# EAGLE design shadower (EAGLE 7.2.0)
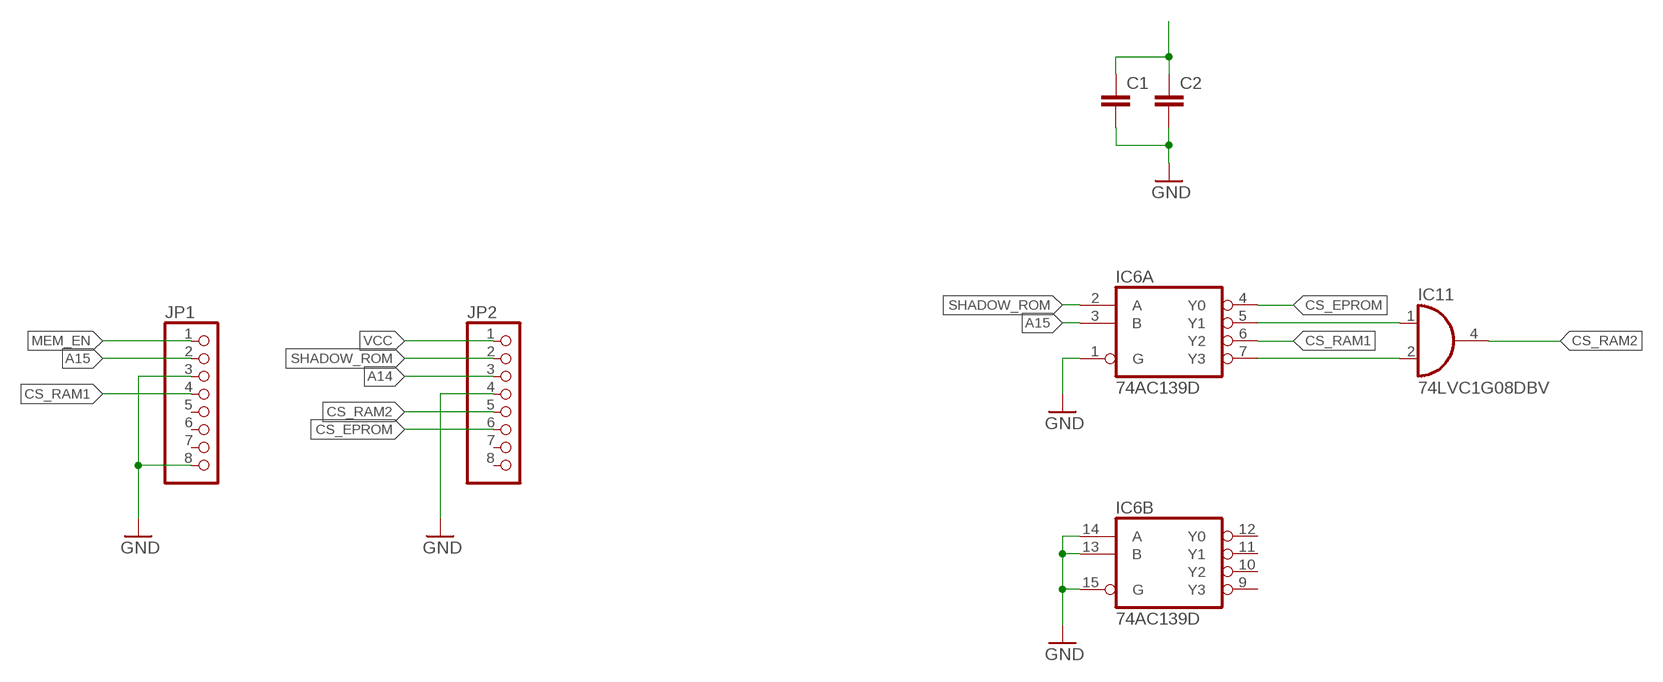
[diagram p0: schematic, sheet 1]

## Parts
C1  C-EUC0603  [C0603]
C2  C-EUC0603  [C0603]
IC6  74AC139D  [SO16]
IC11  74LVC1G08DBV  [SOT23-5]
JP1  PINHD-1X8  [1X08]
JP2  PINHD-1X8  [1X08]

## Nets
A14: JP2.3
A15: IC6.3(A:B) JP1.2
CS_EPROM: IC6.4(A:Y0) JP2.6
CS_RAM1: IC6.6(A:Y2) JP1.4
CS_RAM2: IC11.4(O) JP2.5
GND: C1.2 C2.2 IC6.1(A:G) IC6.13(B:B) IC6.14(B:A) IC6.15(B:G) JP1.3 JP1.8 JP2.4
MEM_EN: JP1.1
N$2: IC6.5(A:Y1) IC11.1(I0)
N$8: IC6.7(A:Y3) IC11.2(I1)
SHADOW_ROM: IC6.2(A:A) JP2.2
VCC: C1.1 C2.1 JP2.1
Unconnected: IC6.9(B:Y3) IC6.10(B:Y2) IC6.11(B:Y1) IC6.12(B:Y0) JP1.5 JP1.6 JP1.7 JP2.7 JP2.8

## Power pins joined to a net without a drawn wire
GND: IC6.8(P:GND) IC11.3(GND)
VCC: IC6.16(P:VCC) IC11.5(VCC)

## Library data of the parts
C1 C2 = rcl:C-EU: CAPACITOR, European symbol
IC6 = 74xx-eu:74*139: Dual 2-line to 4-line DECODER/DEMULTIPLEXER
IC11 = 74xx-little-de:74*1G08: 2-input AND gate
JP1 JP2 = pinhead:PINHD-1X8: PIN HEADER

## Board
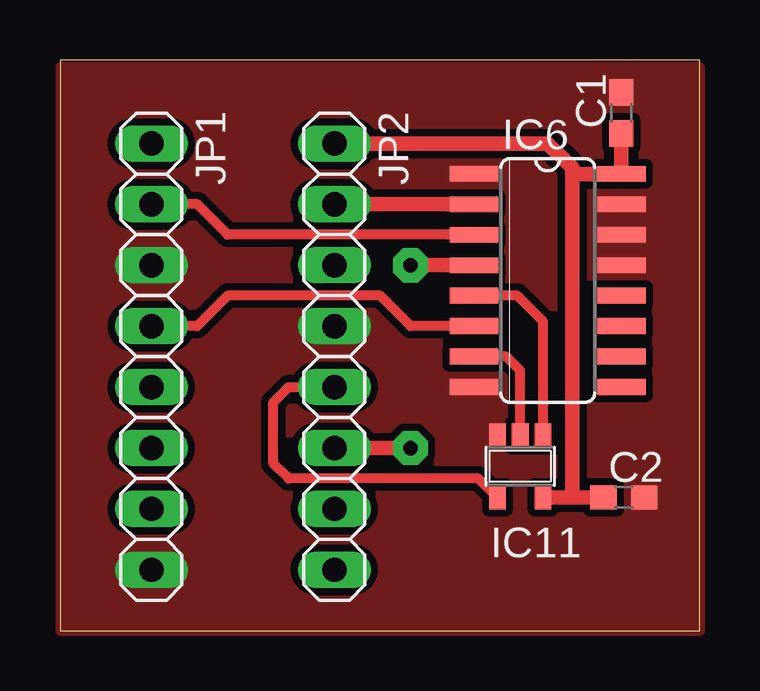
[diagram p1: board, top side]
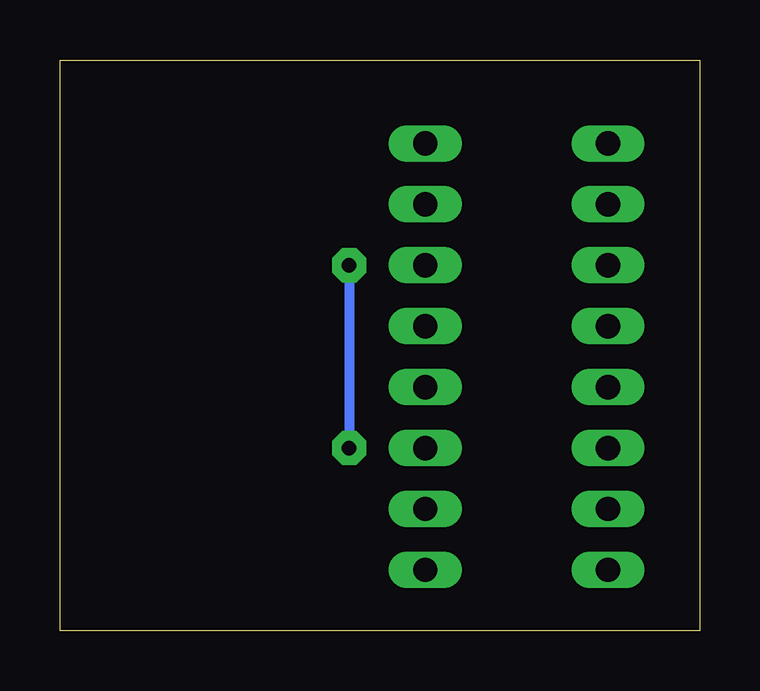
[diagram p2: board, bottom side, seen from below]

Size 26.65 x 23.8 mm. Coordinates in mm from the lower left corner, seen from the top.
Outline: 0,0 26.65,0 26.65,23.8 0,23.8 0,0
Copper layers (1*16): Top 0.035mm / dielectric 1.5mm / Bottom 0.035mm
Design rules "default *": minimum track width 10mil, minimum drill 24mil, track to track 8mil, track to pad 8mil, pad to pad 8mil, via to via 8mil, smd to smd 8mil, copper to edge 0mil, drill to drill 8mil, minimum pad ring 10mil, minimum via ring 8mil, stop-mask expansion 4mil, vias tented up to drill 0mil, thermal gap 10mil

### Footprints (pad centres in the part's own frame; a part is rotated, then mirrored left to right if it is on the bottom)
C0603 = smd 1.1 x 1: 1 -0.85,0; 2 0.85,0
SO16 = smd 0.66 x 2.032: 1 -4.445,-3.073; 2 -3.175,-3.073; 3 -1.905,-3.073; 4 -0.635,-3.073; 5 0.635,-3.073; 6 1.905,-3.073; 7 3.175,-3.073; 8 4.445,-3.073; 9 4.445,3.073; 10 3.175,3.073; 11 1.905,3.073; 12 0.635,3.073; 13 -0.635,3.073; 14 -1.905,3.073; 15 -3.175,3.073; 16 -4.445,3.073
SOT23-5 = smd 0.69 x 0.99: 1 -0.95,-1.29; 2 0,-1.29; 3 0.95,-1.29; 4 0.95,1.3; 5 -0.95,1.3
1X08 = drill 1.016 long: 1 -8.89,0; 2 -6.35,0; 3 -3.81,0; 4 -1.27,0; 5 1.27,0; 6 3.81,0; 7 6.35,0; 8 8.89,0

### Placement (x,y rotation side)
C1  23.39,21.59 90 top
C2  23.5,5.56 0 top
IC6  20.32,14.61 270 top
IC11  19.18,6.86 180 top
JP1  3.81,11.43 270 top
JP2  11.43,11.43 270 top

### Tracks (layer width: path | path; a pad name or v marks a point on that pad's centre or on a via)
A15
  Top 0.406: IC6.3 6.99,16.51 5.71,17.78 JP1.2
CS_EPROM  (via drill 0.6 pad 1.42)
  Top 0.61: IC6.4 v14.61,15.24 | v14.61,7.62 JP2.6
  Bottom 0.406: v14.61,15.24 v14.61,7.62
CS_RAM1
  Top 0.406: IC6.6 14.61,12.7 13.34,13.97 6.99,13.97 5.71,12.7 JP1.4
CS_RAM2
  Top 0.406: IC11.4 17.43,6.35 9.53,6.35 8.89,6.99 8.89,9.53 9.53,10.16 JP2.5
GND
  pour Top (isolate 0.305, no thermals): 0,23.5 0,0 26.67,0 26.67,23.5
N$2
  Top 0.406: IC11.1 20.13,12.89 19.05,13.97 IC6.5
N$8
  Top 0.406: IC11.2 19.18,10.85 18.59,11.43 IC6.7
SHADOW_ROM
  Top 0.61: IC6.2 JP2.2
VCC
  Top 0.61: 21.34,19.05 IC6.16 C1.1 | JP2.1 20.32,20.32 21.34,19.3 21.34,19.05 | 21.34,19.05 21.34,5.56 | IC11.5 21.34,5.56 | 21.34,5.56 C2.1